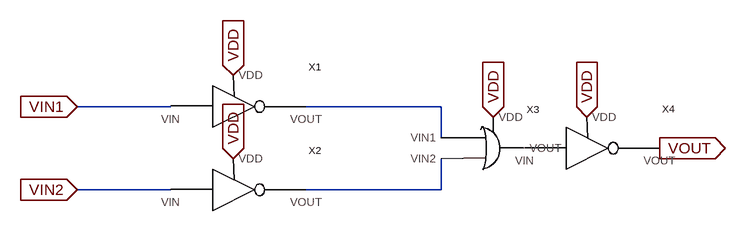
[diagram p0: schematic and.asc]
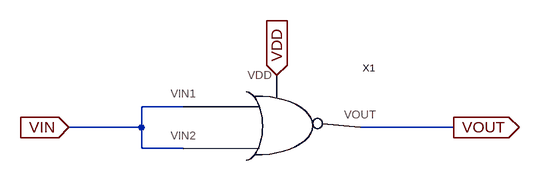
[diagram p1: sub-circuit not.asc]
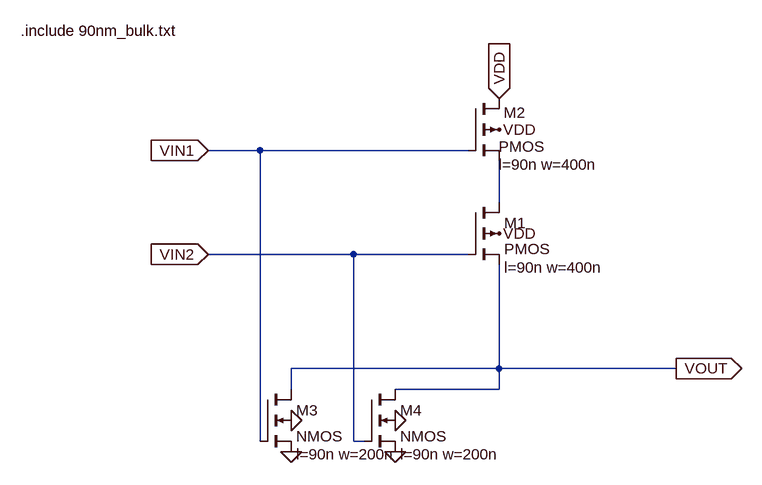
[diagram p2: sub-circuit nor.asc]
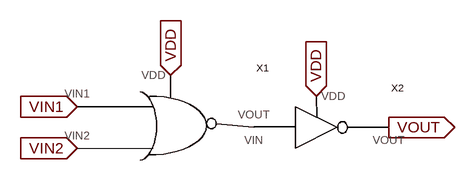
[diagram p3: sub-circuit or.asc]
and.asc, the LTspice schematic file:
Version 4
SHEET 1 956 680
WIRE 112 112 -32 112
WIRE 528 112 320 112
WIRE 528 160 528 112
WIRE 112 240 -32 240
WIRE 528 240 528 192
WIRE 528 240 320 240
FLAG -32 112 VIN1
IOPIN -32 112 In
FLAG -32 240 VIN2
IOPIN -32 240 In
FLAG 208 64 VDD
IOPIN 208 64 In
FLAG 752 128 VDD
IOPIN 752 128 In
FLAG 208 192 VDD
IOPIN 208 192 In
FLAG 864 176 VOUT
IOPIN 864 176 Out
FLAG 608 128 VDD
IOPIN 608 128 In
SYMBOL not 224 112 R0
SYMATTR InstName X1
SYMBOL not 224 240 R0
SYMATTR InstName X2
SYMBOL not 768 176 R0
SYMATTR InstName X4
SYMBOL or 592 176 R0
SYMATTR InstName X3

not.asc, the sub-circuit schematic file:
Version 4
SHEET 1 880 680
WIRE 80 144 16 144
WIRE 16 176 16 144
WIRE 16 176 -96 176
WIRE 496 176 352 176
WIRE 16 208 16 176
WIRE 80 208 16 208
FLAG -96 176 VIN
IOPIN -96 176 In
FLAG 496 176 VOUT
IOPIN 496 176 Out
FLAG 224 96 VDD
IOPIN 224 96 In
SYMBOL nor 240 144 R0
SYMATTR InstName X1

nor.asc, the sub-circuit schematic file:
Version 4
SHEET 1 992 680
WIRE -240 192 -320 192
WIRE 80 192 -240 192
WIRE 128 272 128 208
WIRE -96 352 -320 352
WIRE 80 352 -96 352
WIRE 128 528 128 368
WIRE 128 528 -192 528
WIRE 400 528 128 528
WIRE -192 560 -192 528
WIRE 128 560 128 528
WIRE 128 560 -32 560
WIRE -240 640 -240 192
WIRE -96 640 -96 352
WIRE -80 640 -96 640
FLAG 128 160 VDD
FLAG -192 656 0
FLAG -32 656 0
FLAG -32 608 0
FLAG -192 608 0
FLAG 128 320 VDD
FLAG -320 192 VIN1
IOPIN -320 192 In
FLAG -320 352 VIN2
IOPIN -320 352 In
FLAG 400 528 VOUT
IOPIN 400 528 Out
FLAG 128 112 VDD
IOPIN 128 112 In
SYMBOL pmos4 80 112 R0
WINDOW 0 55 22 Left 2
WINDOW 3 47 74 Left 2
WINDOW 123 47 102 Left 2
SYMATTR InstName M2
SYMATTR Value2 l=90n w=400n
SYMBOL pmos4 80 272 R0
WINDOW 123 56 100 Left 2
SYMATTR Value2 l=90n w=400n
SYMATTR InstName M1
SYMBOL nmos4 -240 560 R0
WINDOW 123 56 100 Left 2
SYMATTR Value2 l=90n w=200n
SYMATTR InstName M3
SYMBOL nmos4 -80 560 R0
WINDOW 123 56 100 Left 2
SYMATTR Value2 l=90n w=200n
SYMATTR InstName M4
TEXT -608 8 Left 2 !.include 90nm_bulk.txt

or.asc, the sub-circuit schematic file:
Version 4
SHEET 1 880 680
FLAG 48 128 VIN1
IOPIN 48 128 In
FLAG 48 192 VIN2
IOPIN 48 192 In
FLAG 528 160 VOUT
IOPIN 528 160 Out
FLAG 192 80 VDD
IOPIN 192 80 In
FLAG 416 112 VDD
IOPIN 416 112 In
SYMBOL nor 208 128 R0
SYMATTR InstName X1
SYMBOL not 432 160 R0
SYMATTR InstName X2

The netlist it stands for:
* and.asc
XX1 VIN1 N001 VDD not
XX2 VIN2 N002 VDD not
XX4 P001 VOUT VDD not
XX3 N001 N002 P001 VDD or

* block symbol definitions
.subckt not VIN VOUT VDD
XX1 VIN VIN VOUT VDD nor
.ends not

.subckt nor VIN1 VIN2 VOUT VDD
M2 VDD VIN1 N001 VDD PMOS l=90n w=400n
M1 N001 VIN2 VOUT VDD PMOS l=90n w=400n
M3 VOUT VIN1 0 0 NMOS l=90n w=200n
M4 VOUT VIN2 0 0 NMOS l=90n w=200n
.include 90nm_bulk.txt
.ends nor

.subckt or VIN1 VIN2 VOUT VDD
XX1 VIN1 VIN2 P001 VDD nor
XX2 P001 VOUT VDD not
.ends or

.model NMOS NMOS
.model PMOS PMOS
.lib standard.mos
.backanno
.end